# Altium schematic sheet main.SchDoc: Main Sebnsorhub
size A4; Date: 27.09.2020; CheckedBy: UNCHECKED; Author: Eric Gorkow/Lukas Deeken; DrawnBy: Baltic Racing; Organization: Team Starcraft e.V.; Address1: Oberweg 2; Address2: 98704 Langewiesen; DocumentNumber: 1; Revision: 2.2; SheetNumber: 4; SheetTotal: 5; Rules: TODO; ProjectName: Projekt
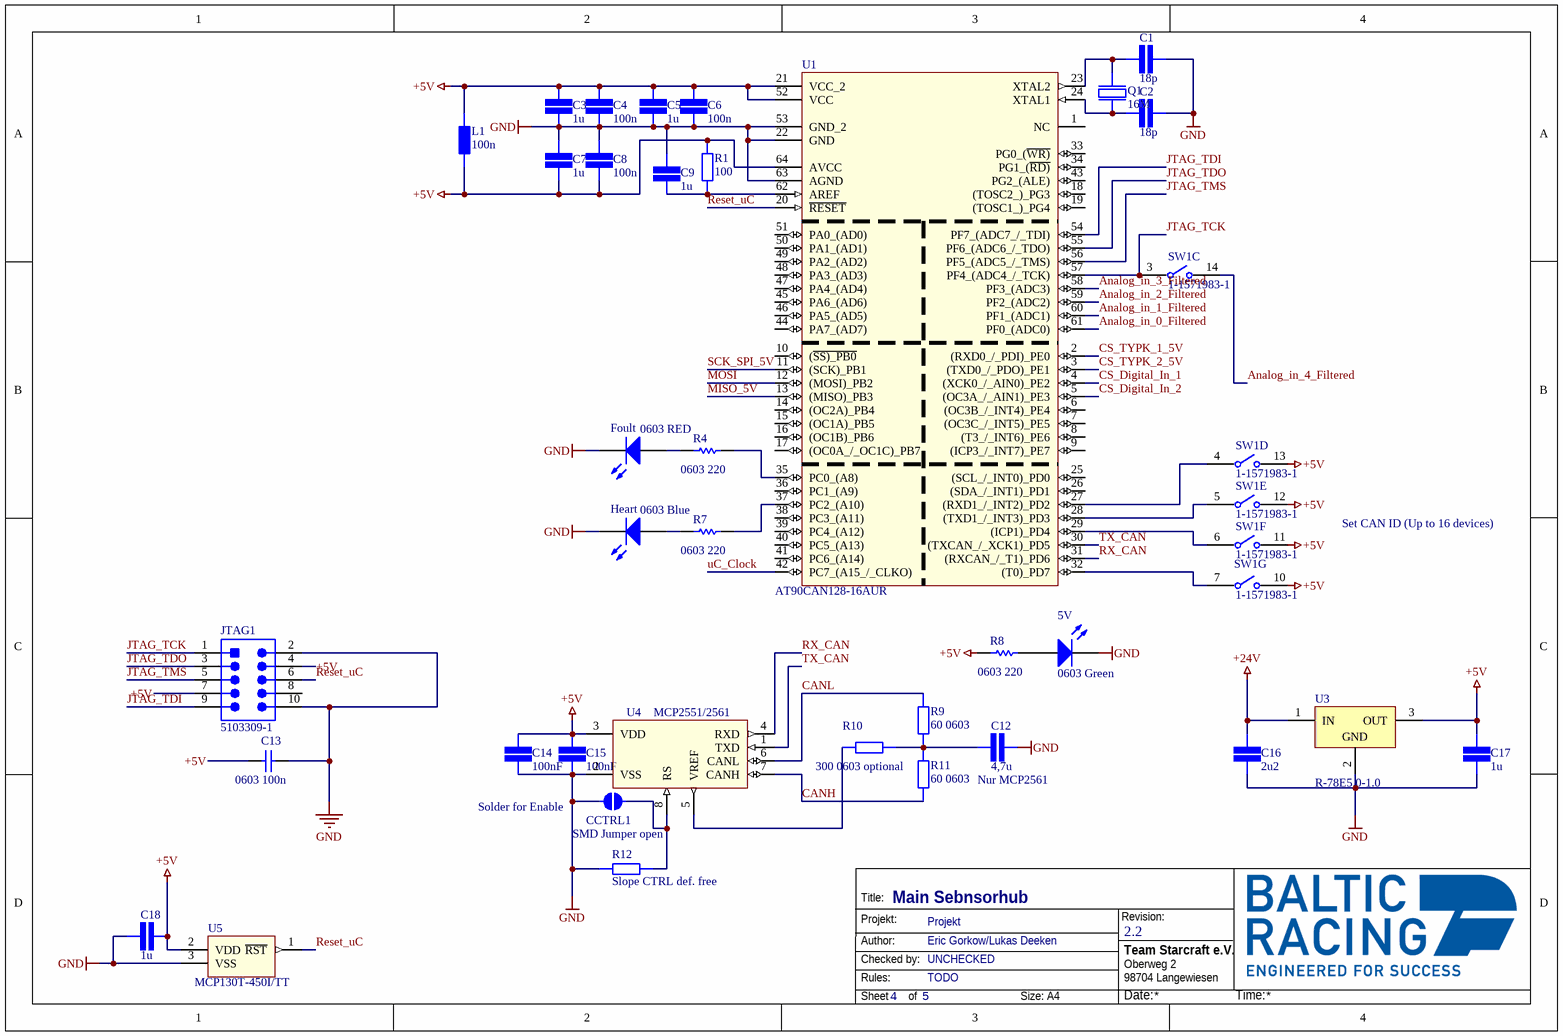
[diagram p0: main.SchDoc]

## Parts
5V  0603 Green  [0603_A]
C1  value 18p  [CAP 0603/1608]  (hidden comment: SMD Capacitor)
C2  value 18p  [CAP 0603/1608]  (hidden comment: SMD Capacitor)
C3  value 1u  [CAP 0603/1608]  (hidden comment: SMD Capacitor)
C4  value 100n  [CAP 0603/1608]  (hidden comment: SMD Capacitor)
C5  value 1u  [CAP 0603/1608]  (hidden comment: SMD Capacitor)
C6  value 100n  [CAP 0603/1608]  (hidden comment: SMD Capacitor)
C7  value 1u  [CAP 0603/1608]  (hidden comment: SMD Capacitor)
C8  value 100n  [CAP 0603/1608]  (hidden comment: SMD Capacitor)
C9  value 1u  [CAP 0603/1608]  (hidden comment: SMD Capacitor)
C12  value 4,7u  [CAP 0603/1608]  (hidden comment: SMD Capacitor)
C13  0603 100n  [CAPC0603(1608)100_L]
C14  value 100nF  [CAP 0603/1608]  (hidden comment: SMD Capacitor)
C15  value 100nF  [CAP 0603/1608]  (hidden comment: SMD Capacitor)
C16  value 2u2  [CAP 0603/1608]  (hidden comment: SMD Capacitor)
C17  value 1u  [CAP 0603/1608]  (hidden comment: SMD Capacitor)
C18  value 1u  [CAP 0603/1608]  (hidden comment: SMD Capacitor)
CCTRL1  SMD Jumper open  [SMD-JUMPER-OPEN]  (no BOM)
Foult  0603 RED  [0603_A]
Heart  0603 Blue  [0603_A]
JTAG1  5103309-1  [TECO-5103309-1_V]
L1  value 100n  [SMD-Inductor 1206]  (hidden comment: SMD Inductor)
Q1  16M  [NDK NX5032GA]
R1  value 100  [STACKPOLE CSR0603]  (hidden comment: SMD Resistor)
R4  0603 220  [RESC1609X50X30NL10T20]
R7  0603 220  [RESC1609X50X30NL10T20]
R8  0603 220  [RESC1608X55X25ML10T15]
R9  value 60 0603  [STACKPOLE CSR0603]  (hidden comment: SMD Resistor)
R10  value 300 0603 optional  [STACKPOLE CSR0603]  (hidden comment: SMD Resistor)
R11  value 60 0603  [STACKPOLE CSR0603]  (hidden comment: SMD Resistor)
R12  value Slope CTRL def. free  [STACKPOLE CSR0603]  (hidden comment: SMD Resistor)
SW1  1-1571983-1  [FP-1-1571983-1-MFG]  (parts C,D,E,F,G of 8)
U1  AT90CAN128-16AUR  [*QFP80P1600X1600X120-64N]
U3  R-78E5.0-1.0  [SIP3_RECOM]
U4  MCP2551/2561  [*SOIC127P600X175-8N]
U5  MCP130T-450I/TT  [*SOT95P237X112-3N]

## Nets
+5V: C3.2 C4.2 C5.2 C6.2 C7.1 C8.1 C13.1 C14.2 C15.2 C17.2 C18.1 JTAG1.4 JTAG1.7 L1.1 L1.2 R1.2 R8.1 SW1.10 SW1.11 SW1.12 SW1.13 U1.21(VCC_2) U1.52(VCC) U1.64(AVCC) U3.3(OUT) U4.3(VDD) U5.2(VDD)
+24V: C16.2 U3.1(IN)
GND: 5V.1(K) C1.1 C2.1 C3.1 C4.1 C5.1 C6.1 C7.2 C8.2 C9.2 C12.2 C13.2 C14.1 C15.1 C16.1 C17.1 C18.2 CCTRL1.1 Foult.1(K) Heart.1(K) JTAG1.2 JTAG1.10 R12.1 U1.22(GND) U1.53(GND_2) U1.63(AGND) U3.2(GND) U4.2(VSS) U5.3(VSS)
Analog_in_0_Filtered: U1.61(PF0_(ADC0))
Analog_in_1_Filtered: U1.60(PF1_(ADC1))
Analog_in_2_Filtered: U1.59(PF2_(ADC2))
Analog_in_3_Filtered: U1.58(PF3_(ADC3))
Analog_in_4_Filtered: SW1.14
CANH: R11.2 U4.7(CANH)
CANL: R9.1 U4.6(CANL)
CS_Digital_In_1: U1.4((XCK0_/_AIN0)_PE2)
CS_Digital_In_2: U1.5((OC3A_/_AIN1)_PE3)
CS_TYPK_1_5V: U1.2((RXD0_/_PDI)_PE0)
CS_TYPK_2_5V: U1.3((TXD0_/_PDO)_PE1)
JTAG_TCK: JTAG1.1 SW1.3 U1.57(PF4_(ADC4_/_TCK))
JTAG_TDI: JTAG1.9 U1.54(PF7_(ADC7_/_TDI))
JTAG_TDO: JTAG1.3 U1.55(PF6_(ADC6_/_TDO))
JTAG_TMS: JTAG1.5 U1.56(PF5_(ADC5_/_TMS))
MISO_5V: U1.13((MISO)_PB3)
MOSI: U1.12((MOSI)_PB2)
Reset_uC: JTAG1.6 U1.20(~{RESET}) U5.1(~{RST})
RX_CAN: U1.31((RXCAN_/_T1)_PD6) U4.4(RXD)
SCK_SPI_5V: U1.11((SCK)_PB1)
TX_CAN: U1.30((TXCAN_/_XCK1)_PD5) U4.1(TXD)
uC_Clock: U1.42(PC7_(A15_/_CLKO))
Net5V_2: 5V.2(A) R8.2
NetC1_2: C1.2 Q1.2 U1.23(XTAL2)
NetC2_2: C2.2 Q1.1 U1.24(XTAL1)
NetC9_1: C9.1 R1.1 U1.62(AREF)
NetC12_1: C12.1 R9.2 R10.2 R11.1
NetCCTRL1_2: CCTRL1.2 R12.2 U4.8(RS)
NetFoult_2: Foult.2(A) R4.2
NetHeart_2: Heart.2(A) R7.2
NetR4_1: R4.1 U1.35(PC0_(A8))
NetR7_1: R7.1 U1.37(PC2_(A10))
NetR10_1: R10.1 U4.5(VREF)
NetSW1_4: SW1.4 U1.27((RXD1_/_INT2)_PD2)
NetSW1_5: SW1.5 U1.28((TXD1_/_INT3)_PD3)
NetSW1_6: SW1.6 U1.29((ICP1)_PD4)
NetSW1_7: SW1.7 U1.32((T0)_PD7)

Not connected (* = marked no-connect by the designer): JTAG1 8; U1 1(NC) 6((OC3B_/_INT4)_PE4) 7((OC3C_/_INT5)_PE5) 8((T3_/_INT6)_PE6) 9((ICP3_/_INT7)_PE7) 10((~{SS)_PB0}) 14((OC2A)_PB4) 15((OC1A)_PB5) 16((OC1B)_PB6) 17((OC0A_/_OC1C)_PB7) 18((TOSC2_)_PG3) 19((TOSC1_)_PG4) 25((SCL_/_INT0)_PD0) 26((SDA_/_INT1)_PD1) 33(PG0_(~{WR)}) 34(PG1_(~{RD)}) 36(PC1_(A9)) 38(PC3_(A11)) 39(PC4_(A12)) 40(PC5_(A13)) 41(PC6_(A14)) 43(PG2_(ALE)) 44(PA7_(AD7)) 45(PA6_(AD6)) 46(PA5_(AD5)) 47(PA4_(AD4)) 48(PA3_(AD3)) 49(PA2_(AD2)) 50(PA1_(AD1)) 51(PA0_(AD0))

## Notes on the sheet
- Set CAN ID (Up to 16 devices)
- (near C12) Nur MCP2561
- Solder for Enable
- Title:
- Projekt:
- Revision:
- Author:
- Rules:
- Checked by:
- Sheet
- of
- Size:
- A4
- Date:
- Time:

## Library data of the parts
5V = CMP-1426-00002-1: SMD mono-color Chip LED, WL-SMCW, Green; PartNumber: 150060GS75000; Manufacturer: Wuerth Elektronik; ComponentLink1URL: http://www.we-online.com; ComponentLink2Description: Datasheet; Color: Green; ComponentLink2URL: http://katalog.we-online.com/led/datasheet/150060GS75000.pdf; PackageReference: 0603_A; ComponentLink1Description: Manufacturer URL
C1-C9 C12 C14-C18 = SMD Capacitor: Capacitor with multiple Footprints
C13 = CMP-1035-02579-1: CAP 100nF 10V ±5% 0603 (1608 Metric) Thickness 1mm SMD; Tolerance: Â±5%; Case-EIA: 0603; Case-Metric: 1608; Value: 100nF; Max Thickness: 1 mm; Rated Voltage: 10 V; Technology: SMT
Foult Heart = CMP-1426-00003-1: SMD mono-color Chip LED, WL-SMCW, Blue; PartNumber: 150060BS75000; Manufacturer: Wuerth Elektronik; Color: Blue; ComponentLink2Description: Datasheet; ComponentLink2URL: http://katalog.we-online.com/led/datasheet/150060BS75000.pdf; ComponentLink1URL: http://www.we-online.com; PackageReference: 0603_A; ComponentLink1Description: Manufacturer URL
JTAG1 = CMP-2000-07502-1: Male Header, Pitch 2.54 mm, 2 x 5 Position, Height 9.855 mm, Tail Length 3.048 mm, -65 to 105 degC, RoHS, Tube; Manufacturer: TE Connectivity; PCB Mounting Orientation: Vertical; Pitch: 2.54mm; Mating Connector Lock: No(Without); Body Material: Thermoplastic; Shrouded: Yes(With); Connector System: Wire-to-Board; Insulation Resistance: 5GR; Number of Positions: 10; Max Current Rating: 1A; PCB Mount Retention: Without; Manufacturer URL: http://www.te.com/; Contact Plating: Gold; Datasheet URL: http://www.te.com/commerce/DocumentDelivery/DDEController?Action=showdoc&DocId=Customer+Drawing%7F5103309%7FE1%7Fpdf%7FEnglish%7FENG_CD_5103309_E1.pdf%7F5103309-1; Colour: Black; Termination: ThroughHole; Housing Colour: Black; Flammability Rating: UL94V-0; Package Description: Male Header, Pitch 2.54 mm, 2 x 5 Position, Height 9.855 mm, Tail Length 3.048 mm; Mating Retention: No(Without); Orientation: Straight; Row Spacing: 2.54mm; Termination Post Length: 0.12inch; Min Operating Temperature: -65degC; Board Standoff: Yes(With); REACH SVHC: NoSVHC; Depth: 9.14mm; Lead Free: LeadFree; Gender: Male; Connector Type: Header; Shrouded End Dimension: 3.81mm; ELV: Compliant; Mating Alignment: Yes(With); Panel Mount Retention: No(Without); Package Quantity: 35; PCB Mount Alignment: No(Without); Number of Rows: 2; Package Reference: 5103309-1; Mounting Technology: ThroughHole; Mount: ThroughHole; Contact Gender: Male; Number of Contacts: 10; Length: 0.8inch; Current Rating: 1A; Contact Mating Length: 0.24inch; Max Operating Temperature: 105degC; RoHSCompliant: True; Datasheet Version: Rev. E1, 03/2011; Contact Shape: Square; Height: 8.813mm; Housing Material: PBT; Contact Material: CopperAlloy; Packaging: Rail/Tube
Q1 = 16 MHz Quartz
R1 R9-R12 = SMD Resistor: Resistor with multiple footprints
R4 R7 = CMP-2000-03887-1: Manufacturer: Vishay Dale; Part Number: CRCW0603130KFKEA
R8 = CMP-2100-03663-1: Chip Resistor, 100 Ohm, +/- 1%, 0.1 W, -55 to 155 degC, 0603 (1608 Metric), RoHS, Tape and Reel; Manufacturer: Yageo; Voltage Rating (DC): 50V; Power Rating: 100mW; Resistance: 100Ohm; Temperature Coefficient: 100ppm/degreesC; Number of Pins: 2; Tolerance: 1%; Height: 0.45mm; Manufacturer URL: http://www.yageo.com/; Military Standard: Not; Datasheet URL: http://www.yageo.com/NewPortal/yageodocoutput?fileName=/pdf/R-Chip/PYu-RC_Group_51_RoHS_L_5.pdf; Case Code (Imperial): 0603; Termination: SMD/SMT; Lead Free: LeadFree; Max Operating Temperature: 155degC; Case Code (Metric): 1608; RoHSCompliant: true; Voltage Rating: 50V; Width: 0.8mm; Composition: ThickFilm; Depth: 0.8mm; REACH SVHC: Unknown; Min Operating Temperature: -55degC; Packaging: TapeandReel; Package Description: 2-Pin Surface Mount Device, Body 1.6 x 0.8 mm; Length: 1.6mm; Package Reference: 0603; Datasheet Version: Rev. 5, 10/2016; Case/Package: 0603
SW1 = CMP-03400-000003-1: SWITCH SLIDE DIP SPST 25MA 24V; Manufacturer: TE Connectivity; Standoff Height: 0mm; Contact Resistance: 100mΩ; Voltage Rating Dc: 50V; Electromechanical Life: 1000Cycles; Number Of Circuits: 8; Temperature: -30°C to +85°C; Mouser Description: Switch DIP OFF ON SPST 8 Recessed Rocker 0.025A 24VDC Gull Wing 1.27mm SMD T/R; Temperature Range High: +85°C; Manufacturer Part Number: 1-1571983-1; Contact Current Rating: 25mA; Device Class L2: Switches; ComponentLink2Description: Datasheet; Category: Switch; ComponentLink2URL: https://www.te.com/commerce/DocumentDelivery/DDEController?Action=showdoc&DocId=Catalog+Section%7F1308111-1_SWITCHES_CORE_PROGRAM_CATALOG%7F0308%7Fpdf%7FEnglish%7FENG_CS_1308111-1_SWITCHES_CORE_PROGRAM_CATALOG_0308.pdf%7F1-1571983-1; Octopart: https://octopart.com/1-1571983-1-te+connectivity-40115518; Footprint Url: https://www.te.com/commerce/DocumentDelivery/DDEController?Action=showdoc&DocId=Customer+Drawing%7F1571983%7FC6%7Fpdf%7FEnglish%7FENG_CD_1571983_C6.pdf%7F1-1571983-1; Digikey Description: SWITCH SLIDE DIP SPST 25MA 24V; Device Class L3: DIP Switches; Mount: Surface Mount; Throw Configuration: SPST; RoHS: TRUE; Lead Free: Yes; Temperature Range Low: -30°C; Height: 2.56mm; Device Class L1: Electromechanical; Package: 1-1571983-1; Automotive: No
U1 = AT90CAN128-16AI: Ic Mcu 8bit 128kb Flash 64tqfp; MF: Microchip; MP: AT90CAN128-16AI; Package: TQFP-64 Microchip; SnapEDA_Link: https://www.snapeda.com/parts/AT90CAN128-16AI/Microchip/view-part/?ref=snap; Price: None; Availability: Unavailable; Value: *
U3 = R-78E05-1.0: Nonisolated 5V Switchmode converter
U4 = MCP2551-I/SN: MCP2551 Series 5.5 V 1 Mb/s Surface Mount High-Speed CAN Transceiver - SOIC-8; MF: Microchip; MP: MCP2551-I/SN; SnapEDA_Link: https://www.snapeda.com/parts/MCP2551-I/SN/Microchip/view-part/?ref=snap; Price: None; Package: SOIC-8 Microchip; Availability: Unavailable; Value: *
U5 = MCP130T-450I/TT: System Supervisors - Power Supply Monitors with Reset Generators Open Drain Low; MF: Microchip; MP: MCP120T-450I/TT; Price: None; SnapEDA_Link: https://www.snapeda.com/parts/MCP120T-450I/TT/Microchip/view-part/?ref=snap; Package: SOT-23-3 Microchip; Availability: Unavailable; Value: *